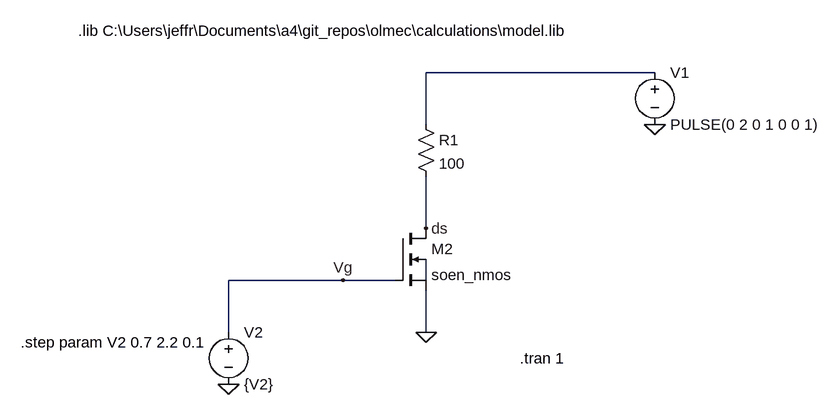
[diagram p0: schematic nmos_IV_sweep.asc]
nmos_IV_sweep.asc, the LTspice schematic file:
Version 4
SHEET 1 2744 1332
WIRE 464 -400 112 -400
WIRE 112 -320 112 -400
WIRE 112 -160 112 -240
WIRE -16 -80 -192 -80
WIRE 64 -80 -16 -80
WIRE 112 -80 112 -112
WIRE -192 0 -192 -80
WIRE 112 0 112 -64
FLAG 464 -320 0
FLAG -192 80 0
FLAG 112 0 0
FLAG 112 -160 ds
FLAG -16 -80 Vg
SYMBOL voltage 464 -416 R0
WINDOW 123 0 0 Left 0
WINDOW 39 0 0 Left 0
SYMATTR InstName V1
SYMATTR Value PULSE(0 2 0 1 0 0 1)
SYMBOL voltage -192 -16 R0
WINDOW 123 0 0 Left 0
WINDOW 39 0 0 Left 0
SYMATTR InstName V2
SYMATTR Value {V2}
SYMBOL res 96 -336 R0
SYMATTR InstName R1
SYMATTR Value 100
SYMBOL nmos4 64 -160 R0
SYMATTR InstName M2
SYMATTR Value soen_nmos
TEXT 256 40 Left 2 !.tran 1
TEXT -512 16 Left 2 !.step param V2 0.7 2.2 0.1
TEXT -424 -464 Left 2 !.lib C:\\Users\\jeffr\\Documents\\a4\\git_repos\\olmec\\calculations\\model.lib

The netlist it stands for:
* nmos_IV_sweep.asc
V1 N001 0 PULSE(0 2 0 1 0 0 1)
V2 Vg 0 {V2}
R1 N001 ds 100
M2 ds Vg 0 N002 soen_nmos
.model NMOS NMOS
.model PMOS PMOS
.lib standard.mos
.tran 1
.step param V2 0.7 2.2 0.1
.lib C:\Users\jeffr\Documents\a4\git_repos\olmec\calculations\model.lib
.backanno
.end